# Altium schematic sheet MCU.SchDoc
size B; SheetNumber: 5; SheetTotal: 5
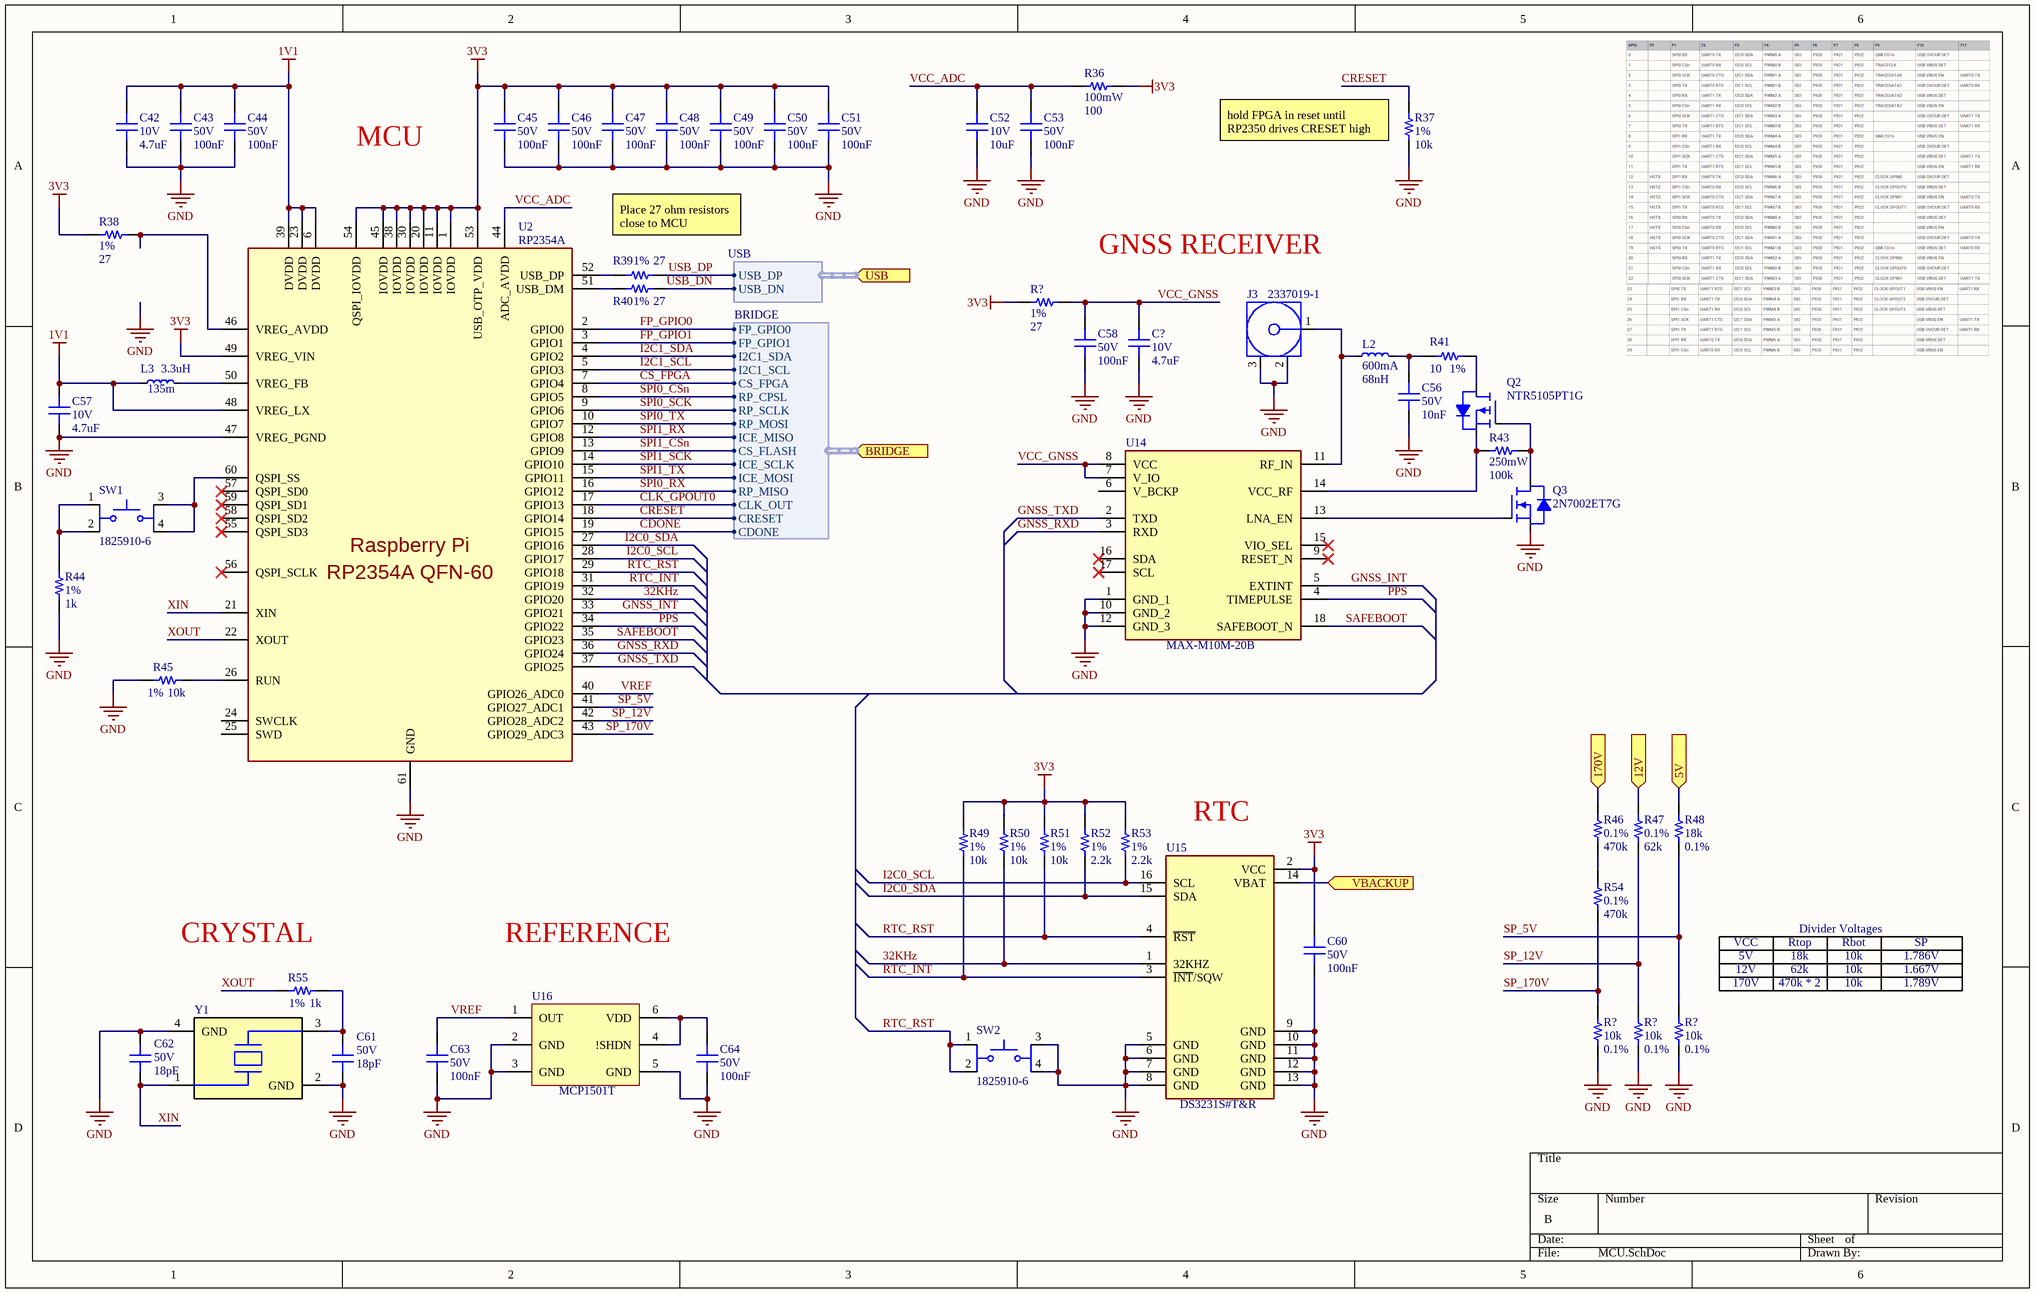
[diagram p0: MCU.SchDoc]

## Parts
(Parts that share a designator on the sheet are numbered #1, #2 ... from top to bottom, then left to right.)
C42  Voltage Rating: 10V  Capacitance: 4.7uF  [0603]  (hidden comment: CL10A475KP8NNNC)
C43  Voltage Rating: 50V  Capacitance: 100nF  [0603]  (hidden comment: MT18B104K500CT)
C44  Voltage Rating: 50V  Capacitance: 100nF  [0603]  (hidden comment: MT18B104K500CT)
C45  Voltage Rating: 50V  Capacitance: 100nF  [0603]  (hidden comment: MT18B104K500CT)
C46  Voltage Rating: 50V  Capacitance: 100nF  [0603]  (hidden comment: MT18B104K500CT)
C47  Voltage Rating: 50V  Capacitance: 100nF  [0603]  (hidden comment: MT18B104K500CT)
C48  Voltage Rating: 50V  Capacitance: 100nF  [0603]  (hidden comment: MT18B104K500CT)
C49  Voltage Rating: 50V  Capacitance: 100nF  [0603]  (hidden comment: MT18B104K500CT)
C50  Voltage Rating: 50V  Capacitance: 100nF  [0603]  (hidden comment: MT18B104K500CT)
C51  Voltage Rating: 50V  Capacitance: 100nF  [0603]  (hidden comment: MT18B104K500CT)
C52  Voltage Rating: 10V  Capacitance: 10uF  [0603]  (hidden comment: 0603X106M100CT)
C53  Voltage Rating: 50V  Capacitance: 100nF  [0603]  (hidden comment: MT18B104K500CT)
C56  Voltage Rating: 50V  Capacitance: 10nF  [0603]  (hidden comment: CL10B103KB8NNNL)
C57  Voltage Rating: 10V  Capacitance: 4.7uF  [0603]  (hidden comment: CL10A475KP8NNNC)
C58  Voltage Rating: 50V  Capacitance: 100nF  [0603]  (hidden comment: MT18B104K500CT)
C60  Voltage Rating: 50V  Capacitance: 100nF  [0603]  (hidden comment: MT18B104K500CT)
C61  Voltage Rating: 50V  Capacitance: 18pF  [0603]  (hidden comment: VJ0603A180FXXPW1BC)
C62  Voltage Rating: 50V  Capacitance: 18pF  [0603]  (hidden comment: VJ0603A180FXXPW1BC)
C63  Voltage Rating: 50V  Capacitance: 100nF  [0603]  (hidden comment: MT18B104K500CT)
C64  Voltage Rating: 50V  Capacitance: 100nF  [0603]  (hidden comment: MT18B104K500CT)
C?  Voltage Rating: 10V  Capacitance: 4.7uF  [0603]  (hidden comment: CL10A475KP8NNNC)
J3  2337019-1  [2337019-1]
L2  Avg Current: 600mA  Inductance: 68nH  (hidden comment: LQW18AS68NG0CD)
L3  Resistance: 135m  Inductance: 3.3uH  [1008]  (hidden comment: MPIA2512V3-3R3-R)
Q2  NTR5105PT1G  [SOT-23-3]
Q3  2N7002ET7G  [SOT-23-3]
R36  Power Rating: 100mW  Resistance: 100  [0603]  (hidden comment: CRG0603F100R)
R37  Tolerance: 1%  Resistance: 10k  [0603]  (hidden comment: CRG0603F10K)
R38  Tolerance: 1%  Resistance: 27  [0603]  (hidden comment: CRGP0603F27R)
R39  Tolerance: 1%  Resistance: 27  [0603]  (hidden comment: CRGP0603F27R)
R40  Tolerance: 1%  Resistance: 27  [0603]  (hidden comment: CRGP0603F27R)
R41  Tolerance: 1%  Resistance: 10  [0603]  (hidden comment: CRGCQ0603F10R)
R43  Power Rating: 250mW  Resistance: 100k  [0603]  (hidden comment: CRGP0603F100K)
R44  Tolerance: 1%  Resistance: 1k  [0603]  (hidden comment: CRGP0603F1K0)
R45  Tolerance: 1%  Resistance: 10k  [0603]  (hidden comment: CRG0603F10K)
R46  Tolerance: 0.1%  Resistance: 470k  [0805]  (hidden comment: CPF0805B470KE1)
R47  Tolerance: 0.1%  Resistance: 62k  [0603]  (hidden comment: CPF0603B62KE1)
R48  Resistance: 18k  Tolerance: 0.1%  [0603]  (hidden comment: CPF0603B18KE1)
R49  Tolerance: 1%  Resistance: 10k  [0603]  (hidden comment: CRG0603F10K)
R50  Tolerance: 1%  Resistance: 10k  [0603]  (hidden comment: CRG0603F10K)
R51  Tolerance: 1%  Resistance: 10k  [0603]  (hidden comment: CRG0603F10K)
R52  Tolerance: 1%  Resistance: 2.2k  [0603]  (hidden comment: CRGCQ0603F2K2)
R53  Tolerance: 1%  Resistance: 2.2k  [0603]  (hidden comment: CRGCQ0603F2K2)
R54  Tolerance: 0.1%  Resistance: 470k  [0805]  (hidden comment: CPF0805B470KE1)
R55  Tolerance: 1%  Resistance: 1k  [0603]  (hidden comment: CRGP0603F1K0)
R?#1  Tolerance: 1%  Resistance: 27  [0603]  (hidden comment: CRGP0603F27R)
R?#2  Resistance: 10k  Tolerance: 0.1%  [0603]  (hidden comment: CPF0603B10KE)
R?#3  Resistance: 10k  Tolerance: 0.1%  [0603]  (hidden comment: CPF0603B10KE)
R?#4  Resistance: 10k  Tolerance: 0.1%  [0603]  (hidden comment: CPF0603B10KE)
SW1  1825910-6
SW2  1825910-6
U2  RP2354A  [QFN-60]
U14  MAX-M10M-20B  [MAX-M10M-20B]
U15  DS3231S#T&R  [SOIC-16 WIDE]
U16  MCP1501T  [SOT-23-6]
Y1  RH100-12.000-12-1010-X-TR-NS2  (value not drawn)

## Ports
5V (in, see Top Sheet[2C], Power[4A]), 12V (in, see Top Sheet[2C], Power[5B]), 170V (in, see Top Sheet[2C], Power[5C]), BRIDGE (in, harness BRIDGE, see Top Sheet[1C], FPGA[2B]), USB (in, harness USB, see Top Sheet[2C], Power[1B]), VBACKUP (in)

## Harnesses
BRIDGE: CS_FPGA, ICE_SCLK, ICE_MOSI, ICE_MISO, CDONE, CRESET, FP_GPIO1, FP_GPIO0, CS_FLASH, RP_SCLK, RP_MOSI, RP_MISO, RP_CPSL, CLK_OUT, I2C1_SCL, I2C1_SDA
USB: USB_DP, USB_DN

## Nets
1V1: C42.2 C43.2 C44.2 C57.2 L3.1 U2.6(DVDD) U2.23(DVDD) U2.39(DVDD) U2.48(VREG_LX)
3V3: C45.2 C46.2 C47.2 C48.2 C49.2 C50.2 C51.2 C60.2 R36.2 R38.2 R49.1 R50.1 R51.1 R52.2 R53.2 R?#1.2 U2.1(IOVDD) U2.11(IOVDD) U2.20(IOVDD) U2.30(IOVDD) U2.38(IOVDD) U2.45(IOVDD) U2.49(VREG_VIN) U2.53(USB_OTP_VDD) U2.54(QSPI_IOVDD) U15.2(VCC)
GND: C42.1 C43.1 C44.1 C45.1 C46.1 C47.1 C48.1 C49.1 C50.1 C51.1 C52.1 C53.1 C56.1 C57.1 C58.1 C60.1 C61.1 C62.2 C63.1 C64.1 C?.1 J3.2(GND) J3.3(GND) Q3.2(S) R37.2 R44.1 R45.2 R?#2.1 R?#3.1 R?#4.1 SW2.3 SW2.4 U2.47(VREG_PGND) U2.61(GND) U14.1(GND_1) U14.10(GND_2) U14.12(GND_3) U15.5(GND) U15.6(GND) U15.7(GND) U15.8(GND) U15.9(GND) U15.10(GND) U15.11(GND) U15.12(GND) U15.13(GND) U16.2(GND) U16.3(GND) U16.5(GND) Y1.2(GND) Y1.4(GND)
5V: R48.2 ; port 5V
12V: R47.2 ; port 12V
32KHz: R50.2 U2.32(GPIO20) U15.1(32KHZ)
170V: R46.2 ; port 170V
CDONE: U2.19(GPIO15) ; port BRIDGE.CDONE
CLK_GPOUT0: U2.17(GPIO13) ; port BRIDGE.CLK_OUT
CRESET: R37.1 U2.18(GPIO14) ; port BRIDGE.CRESET
CS_FPGA: U2.7(GPIO4) ; port BRIDGE.CS_FPGA
FP_GPIO0: U2.2(GPIO0) ; port BRIDGE.FP_GPIO0
FP_GPIO1: U2.3(GPIO1) ; port BRIDGE.FP_GPIO1
GNSS_INT: U2.33(GPIO21) U14.5(EXTINT)
GNSS_RXD: U2.36(GPIO24) U14.3(RXD)
GNSS_TXD: U2.37(GPIO25) U14.2(TXD)
I2C0_SCL: R53.1 U2.28(GPIO17) U15.16(SCL)
I2C0_SDA: R52.1 U2.27(GPIO16) U15.15(SDA)
I2C1_SCL: U2.5(GPIO3) ; port BRIDGE.I2C1_SCL
I2C1_SDA: U2.4(GPIO2) ; port BRIDGE.I2C1_SDA
PPS: U2.34(GPIO22) U14.4(TIMEPULSE)
RTC_INT: R49.2 U2.31(GPIO19) U15.3(~{INT}/SQW)
RTC_RST: R51.2 SW2.1 SW2.2 U2.29(GPIO18) U15.4(~{RST})
SAFEBOOT: U2.35(GPIO23) U14.18(SAFEBOOT_N)
SP_5V: R48.1 R?#4.2 U2.41(GPIO27_ADC1)
SP_12V: R47.1 R?#3.2 U2.42(GPIO28_ADC2)
SP_170V: R54.1 R?#2.2 U2.43(GPIO29_ADC3)
SPI0_CSn: U2.8(GPIO5) ; port BRIDGE.RP_CPSL
SPI0_RX: U2.16(GPIO12) ; port BRIDGE.RP_MISO
SPI0_SCK: U2.9(GPIO6) ; port BRIDGE.RP_SCLK
SPI0_TX: U2.10(GPIO7) ; port BRIDGE.RP_MOSI
SPI1_CSn: U2.13(GPIO9) ; port BRIDGE.CS_FLASH
SPI1_RX: U2.12(GPIO8) ; port BRIDGE.ICE_MISO
SPI1_SCK: U2.14(GPIO10) ; port BRIDGE.ICE_SCLK
SPI1_TX: U2.15(GPIO11) ; port BRIDGE.ICE_MOSI
USB_DN: R40.2 ; port USB.USB_DN
USB_DP: R39.2 ; port USB.USB_DP
VBACKUP: U15.14(VBAT) ; port VBACKUP
VCC_ADC: C52.2 C53.2 R36.1 U2.44(ADC_AVDD)
VCC_GNSS: C58.2 C?.2 R?#1.1 U14.7(V_IO) U14.8(VCC)
VREF: C63.2 U2.40(GPIO26_ADC0) U16.1(OUT)
XIN: C62.1 U2.21(XIN) Y1.1
XOUT: R55.2 U2.22(XOUT)
NetC56_2: C56.2 L2.1 R41.1
NetC61_2: C61.2 R55.1 Y1.3
NetC64_2: C64.2 U16.4(!SHDN) U16.6(VDD)
NetJ3_1: J3.1(SIGNAL) L2.2 U14.11(RF_IN)
NetL3_2: L3.2 U2.50(VREG_FB)
NetQ2_1: Q2.1(G) Q3.3(D) R43.2
NetQ2_2: Q2.2(S) R43.1 U14.14(VCC_RF)
NetQ2_3: Q2.3(D) R41.2
NetQ3_1: Q3.1(G) U14.13(LNA_EN)
NetR38_1: R38.1 U2.46(VREG_AVDD)
NetR39_1: R39.1 U2.52(USB_DP)
NetR40_1: R40.1 U2.51(USB_DM)
NetR44_2: R44.2 SW1.1 SW1.2
NetR45_1: R45.1 U2.26(RUN)
NetR46_1: R46.1 R54.2
NetSW1_3: SW1.3 SW1.4 U2.60(QSPI_SS)

Not connected (* = marked no-connect by the designer): U2 24(SWCLK) 25(SWD) 55(QSPI_SD3)* 56(QSPI_SCLK)* 57(QSPI_SD0)* 58(QSPI_SD2)* 59(QSPI_SD1)*; U14 6(V_BCKP) 9(RESET_N)* 15(VIO_SEL)* 16(SDA)* 17(SCL)*

## Notes on the sheet
- MCU
- (near R37) hold FPGA in reset until RP2350 drives CRESET high
- Place 27 ohm resistors close to MCU
- GNSS RECEIVER
- (near U15) RTC
- (near R55) CRYSTAL
- REFERENCE
- VCC
- 5V
- 12V
- Rtop
- 18k
- 62k
- Divider Voltages
- Rbot
- 10k
- SP
- 1.786V
- 1.667V
- 170V
- 470k * 2
- 1.789V
- (in symbol RP2354A) Raspberry Pi; RP2354A QFN-60

## Library data of the parts
C42 C57 C? = CL10A475KP8NNNC: 4.7 µF ±10% 10V Ceramic Capacitor X5R 0603 (1608 Metric); Dielectric: X5R; Tolerance: 10%
C43-C51 C53 C58 C60 C63 C64 = MT18B104K500CT: 0.1 µF ±10% 50V Ceramic Capacitor X7R 0603 (1608 Metric); Dielectric: X7R; Tolerance: 10%
C52 = 0603X106M100CT: 10 µF ±20% 10V Ceramic Capacitor X5R 0603 (1608 Metric); Dielectric: X5R; Tolerance: 20%
C56 = CL10B103KB8NNNL: 10000 pF ±10% 50V Ceramic Capacitor X7R 0603 (1608 Metric); Tolerance: 10%; Dielectric: X7R
C61 C62 = VJ0603A180FXXPW1BC: 18 pF ±1% 25V Ceramic Capacitor C0G, NP0 0603 (1608 Metric); Dielectric: C0G (NP0); Tolerance: 1%
J3 = 2337019-1: U.FL (UMCC) Connector Receptacle, Male Pin 50 Ohms Surface Mount Solder
L2 = LQW18AS68NG0CD: Resistance: 340m
L3 = MPIA2512V3-3R3-R: 3.3 µH Shielded Molded Inductor 1.8 A 135mOhm Max 1008 (2520 Metric); Sat Current: 2.8A; Avg Current: 1.8A
Q2 = NTR5105PT1G: P-Channel 60 V 196mA (Ta) 347mW (Ta) Surface Mount SOT-23-3 (TO-236)
Q3 = 2N7002ET7G: N-Channel 60 V 260mA (Ta) 300mW (Tj) Surface Mount SOT-23-3 (TO-236)
R36 = CRG0603F100R: 100 Ohms ±1% 0.1W, 1/10W Chip Resistor 0603 (1608 Metric) Thick Film; Temperature Coefficient: 100ppm/c; Tolerance: 1%; Case Code: 0603
R37 R45 R49-R51 = CRG0603F10K: 10 kOhms ±1% 0.1W, 1/10W Chip Resistor 0603 (1608 Metric) Thick Film; Power Rating: 100mW; Temperature Coefficient: 100ppm/c; Case Code: 0603
R38-R40 R?#1 = CRGP0603F27R: 27 Ohms ±1% 0.25W, 1/4W Chip Resistor 0603 (1608 Metric) Automotive AEC-Q200, Pulse Withstanding Thick Film; Power Rating: 100mW; Temperature Coefficient: 100ppm/c; Case Code: 0603
R41 = CRGCQ0603F10R: 10 Ohms ±1% 0.1W, 1/10W Chip Resistor 0603 (1608 Metric) Automotive AEC-Q200, Moisture Resistant Thick Film; Power Rating: 100mW; Temperature Coefficient: 400ppm/c; Case Code: 0603
R43 = CRGP0603F100K: 100 kOhms ±1% 0.25W, 1/4W Chip Resistor 0603 (1608 Metric) Automotive AEC-Q200, Pulse Withstanding Thick Film; Temperature Coefficient: 100ppm/c; Case Code: 0603; Tolerance: 1%
R44 R55 = CRGP0603F1K0: 1 kOhms ±1% 0.25W, 1/4W Chip Resistor 0603 (1608 Metric) Automotive AEC-Q200, Pulse Withstanding Thick Film; Power Rating: 250mW; Temperature Coefficient: 100ppm/c; Case Code: 0603
R46 R54 = CPF0805B470KE1: 470 kOhms ±0.1% 0.1W, 1/10W Chip Resistor 0805 (2012 Metric) Thin Film; Power Rating: 62.5mW; Temperature Coefficient: 25ppm/c; Case Code: 0805
R47 = CPF0603B62KE1: 62 kOhms ±0.1% 0.063W, 1/16W Chip Resistor 0603 (1608 Metric) Thin Film; Power Rating: 62.5mW; Temperature Coefficient: 25ppm/c; Case Code: 0603
R48 = CPF0603B18KE1: 18 kOhms ±0.1% 0.063W, 1/16W Chip Resistor 0603 (1608 Metric) Thin Film; Power Rating: 62.5mW; Temperature Coefficient: 25ppm/c; Case Code: 0603
R52 R53 = CRGCQ0603F2K2: 2.2 kOhms ±1% 0.1W, 1/10W Chip Resistor 0603 (1608 Metric) Automotive AEC-Q200, Moisture Resistant Thick Film; Power Rating: 100mW; Temperature Coefficient: 100ppm/c; Case Code: 0603
R?#2-R?#4 = CPF0603B10KE: 10 kOhms ±0.1% 0.063W, 1/16W Chip Resistor 0603 (1608 Metric) Thin Film; Temperature Coefficient: 25ppm/c; Power Rating: 62.5mW; Case Code: 0603
SW1 SW2 = 1825910-6: Tactile Switch SPST-NO Top Actuated Through Hole
U2 = RP2354A: ARM Microcontrollers - 150MHz clock Dual Arm Cortex-M33 cores 520KB RAM 8KB on-chip OTP storage 7" Reel QFN-60
U14 = MAX-M10M-20B: RF Receiver BeiDou, Galileo, GLONASS, GNSS, GPS, QZSS, SBAS -165dBm 921.6kbps Not Included
U15 = DS3231S#T&R: Real Time Clock (RTC) IC Clock/Calendar I2C, 2-Wire Serial 16-SOIC (0.295", 7.50mm Width)
U16 = MCP1501T: Series Voltage Reference IC Fixed 2.048V V ±0.1% 20 mA SOT-23-6
Y1 = RH100-12.000-12-1010-X-TR-NS2: 12 MHz ±10ppm Crystal 12pF 50 Ohms 4-SMD, No Lead